# EAGLE schematic module (EAGLE 7.7.0)
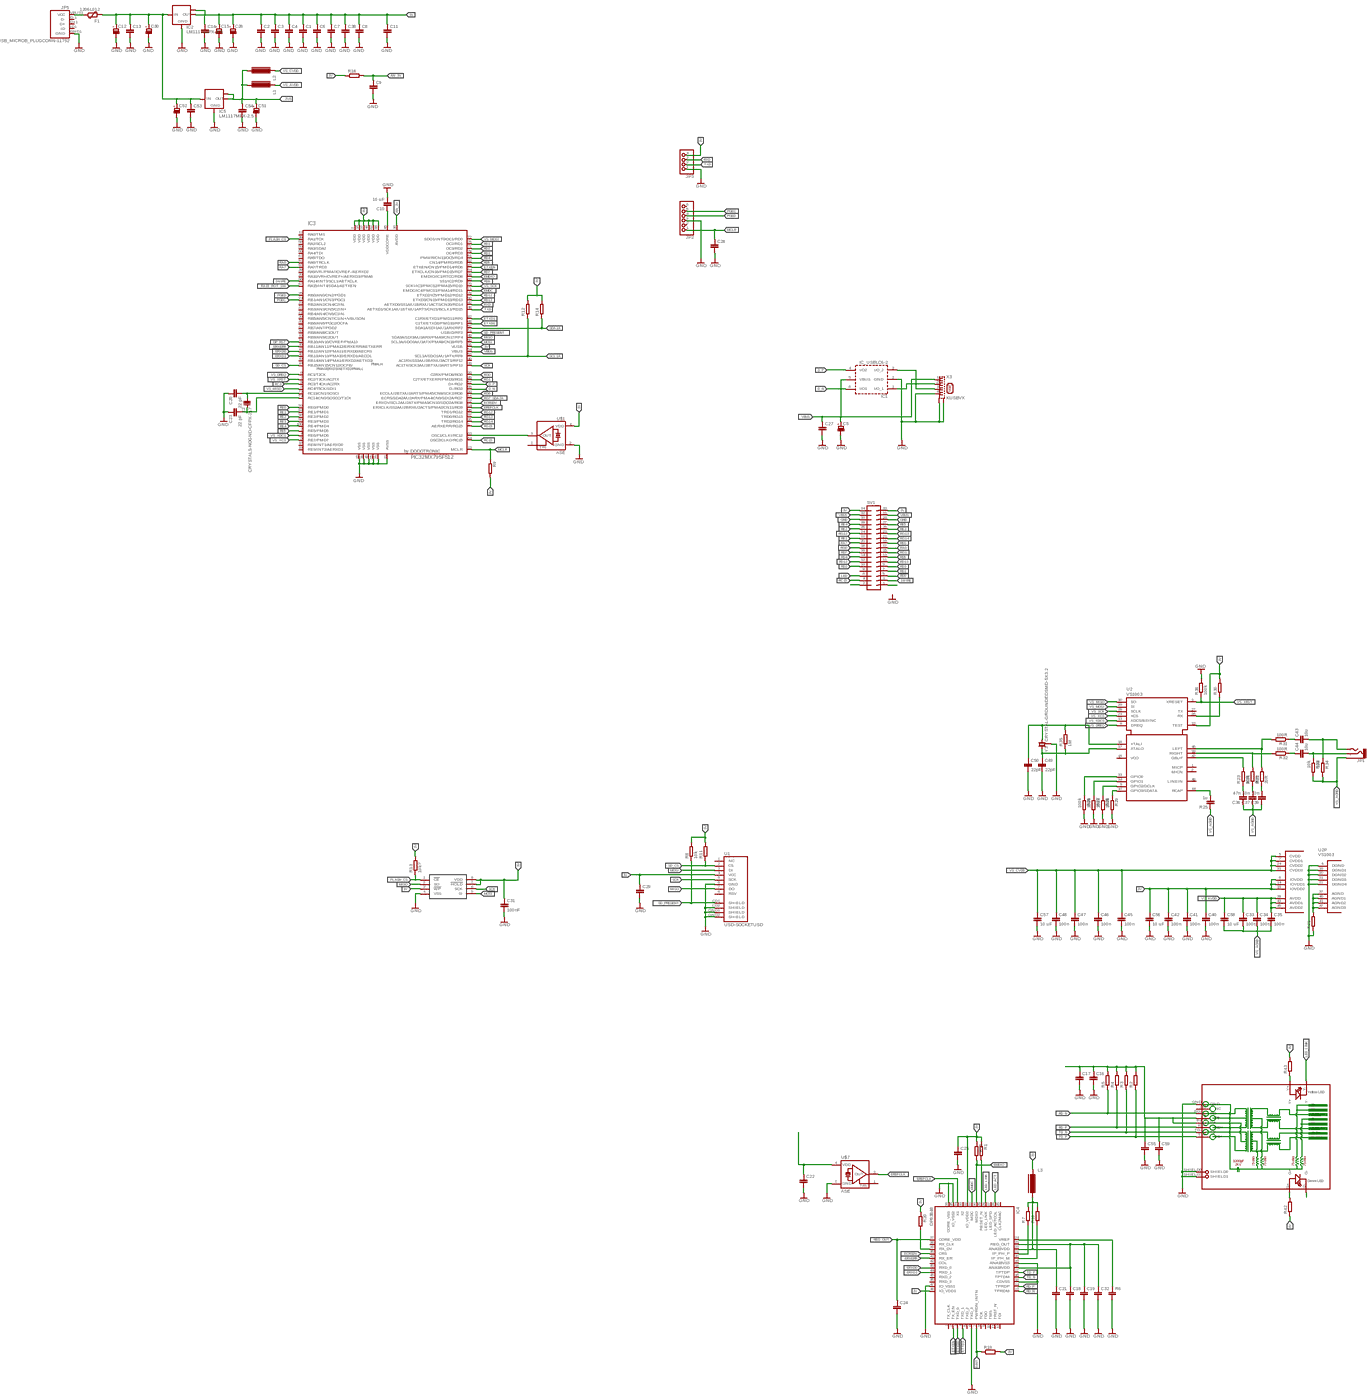
[diagram p0: schematic, sheet 1, overview]
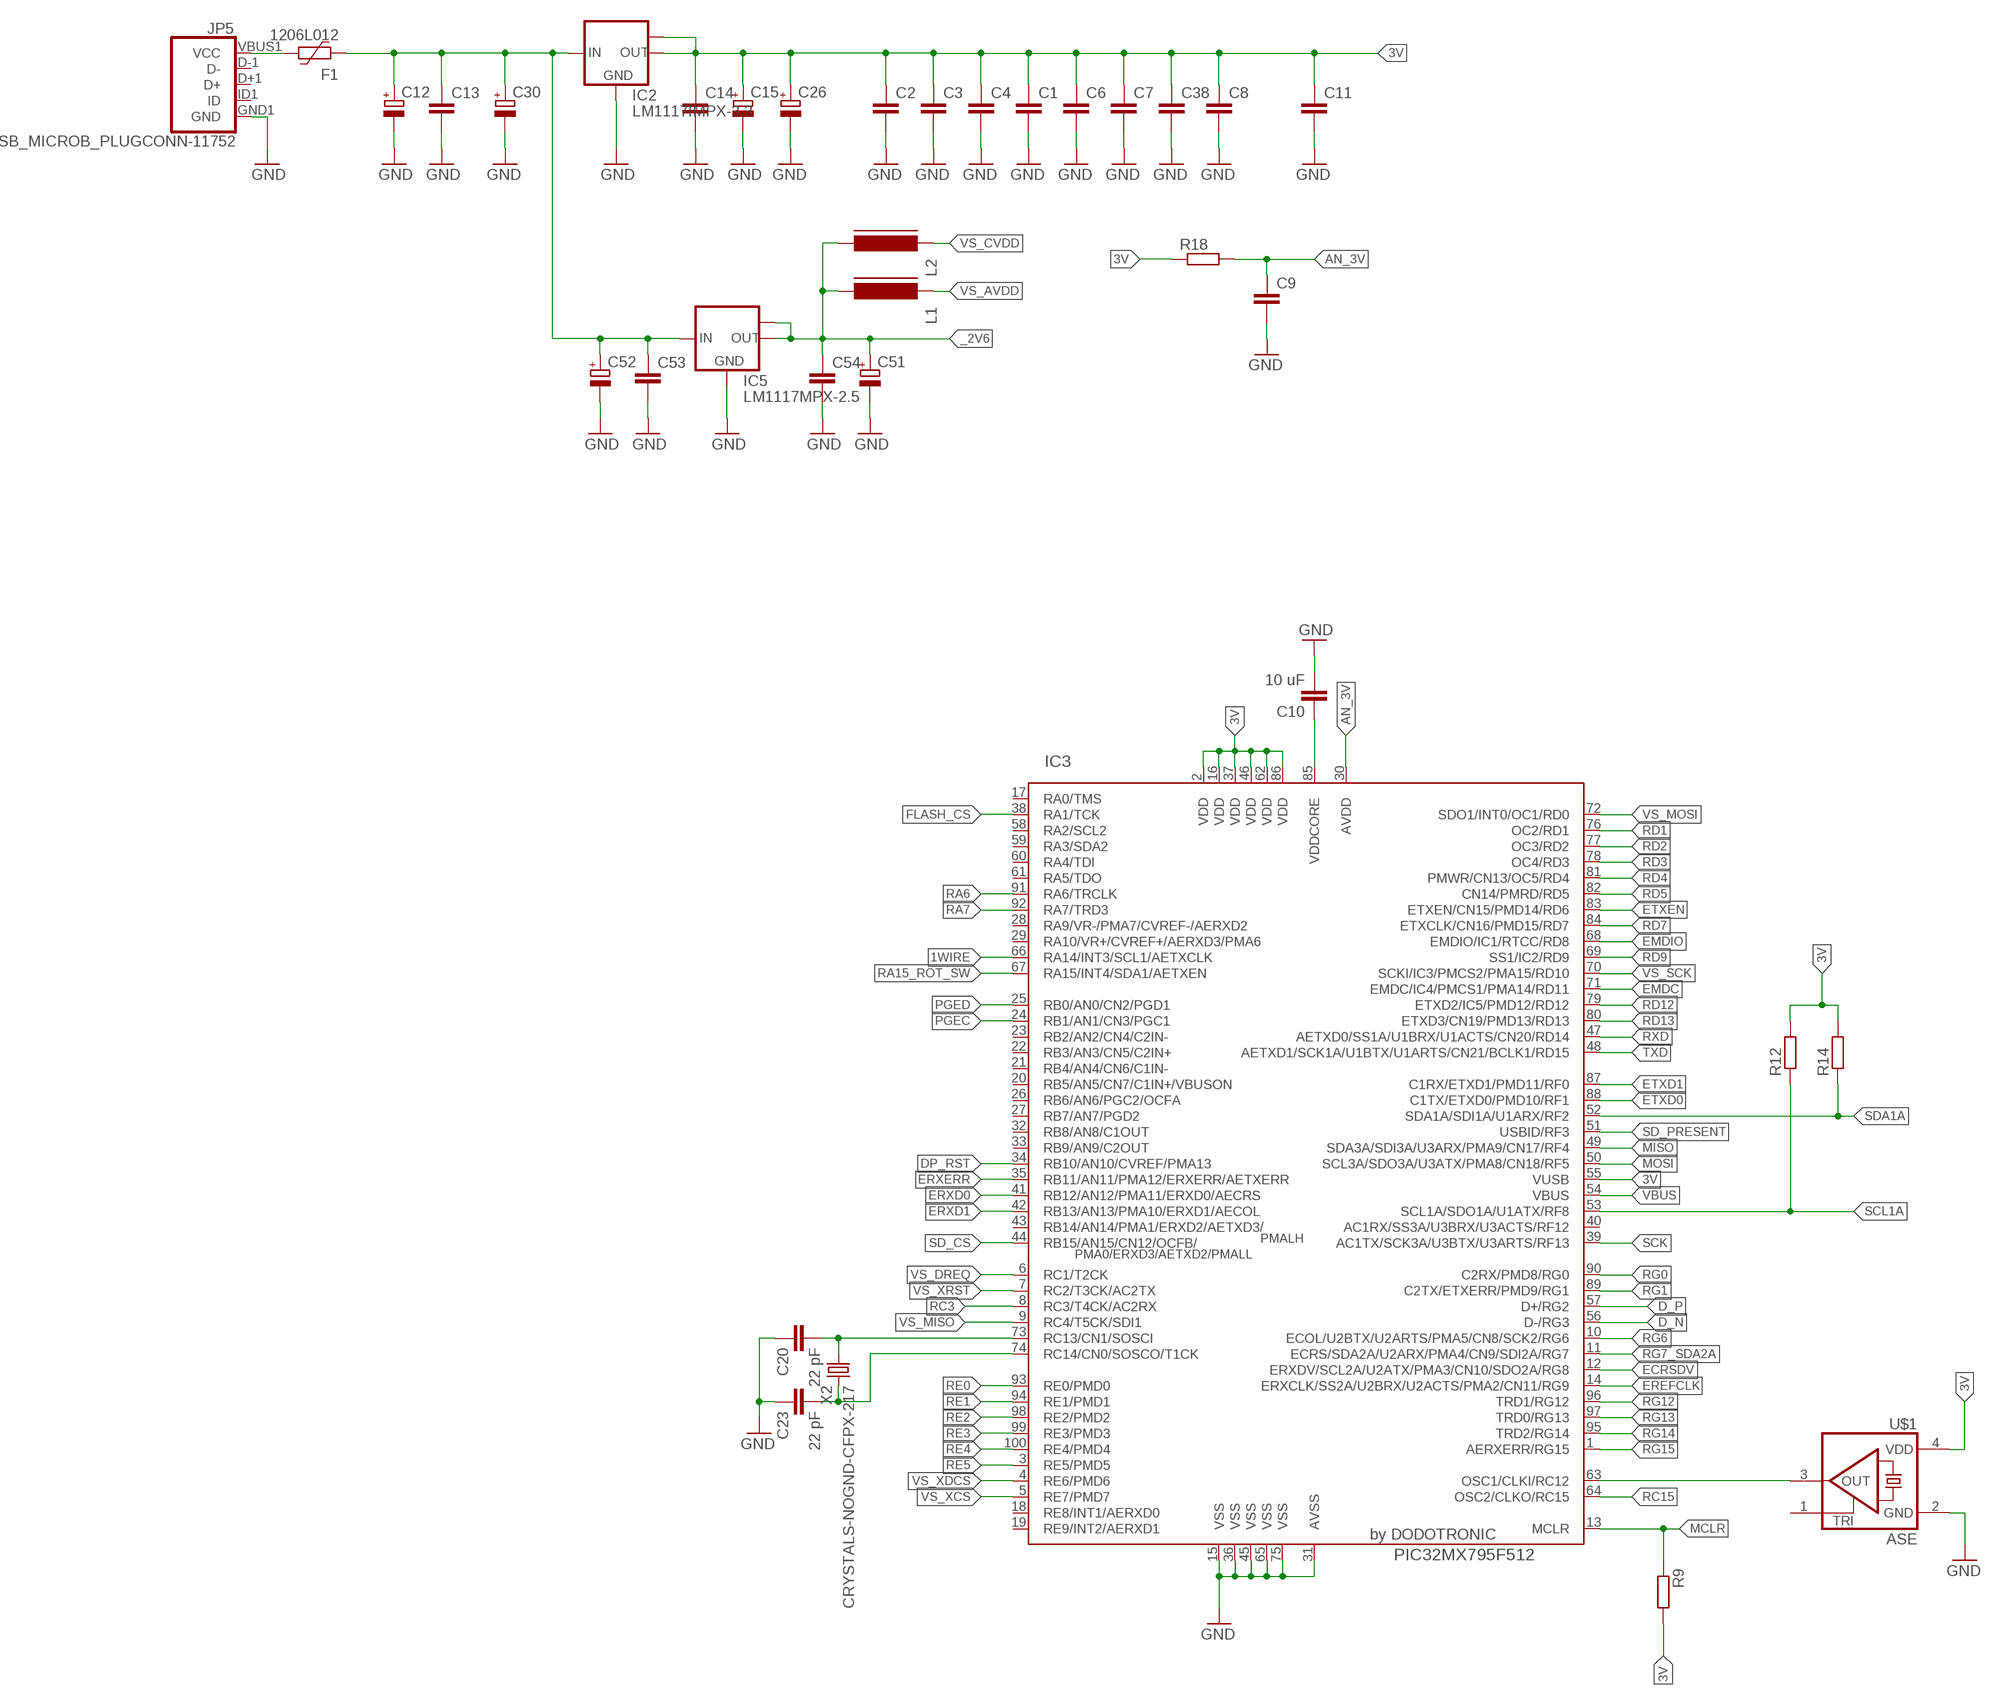
[diagram p1: schematic, sheet 1, part 1 of 4]
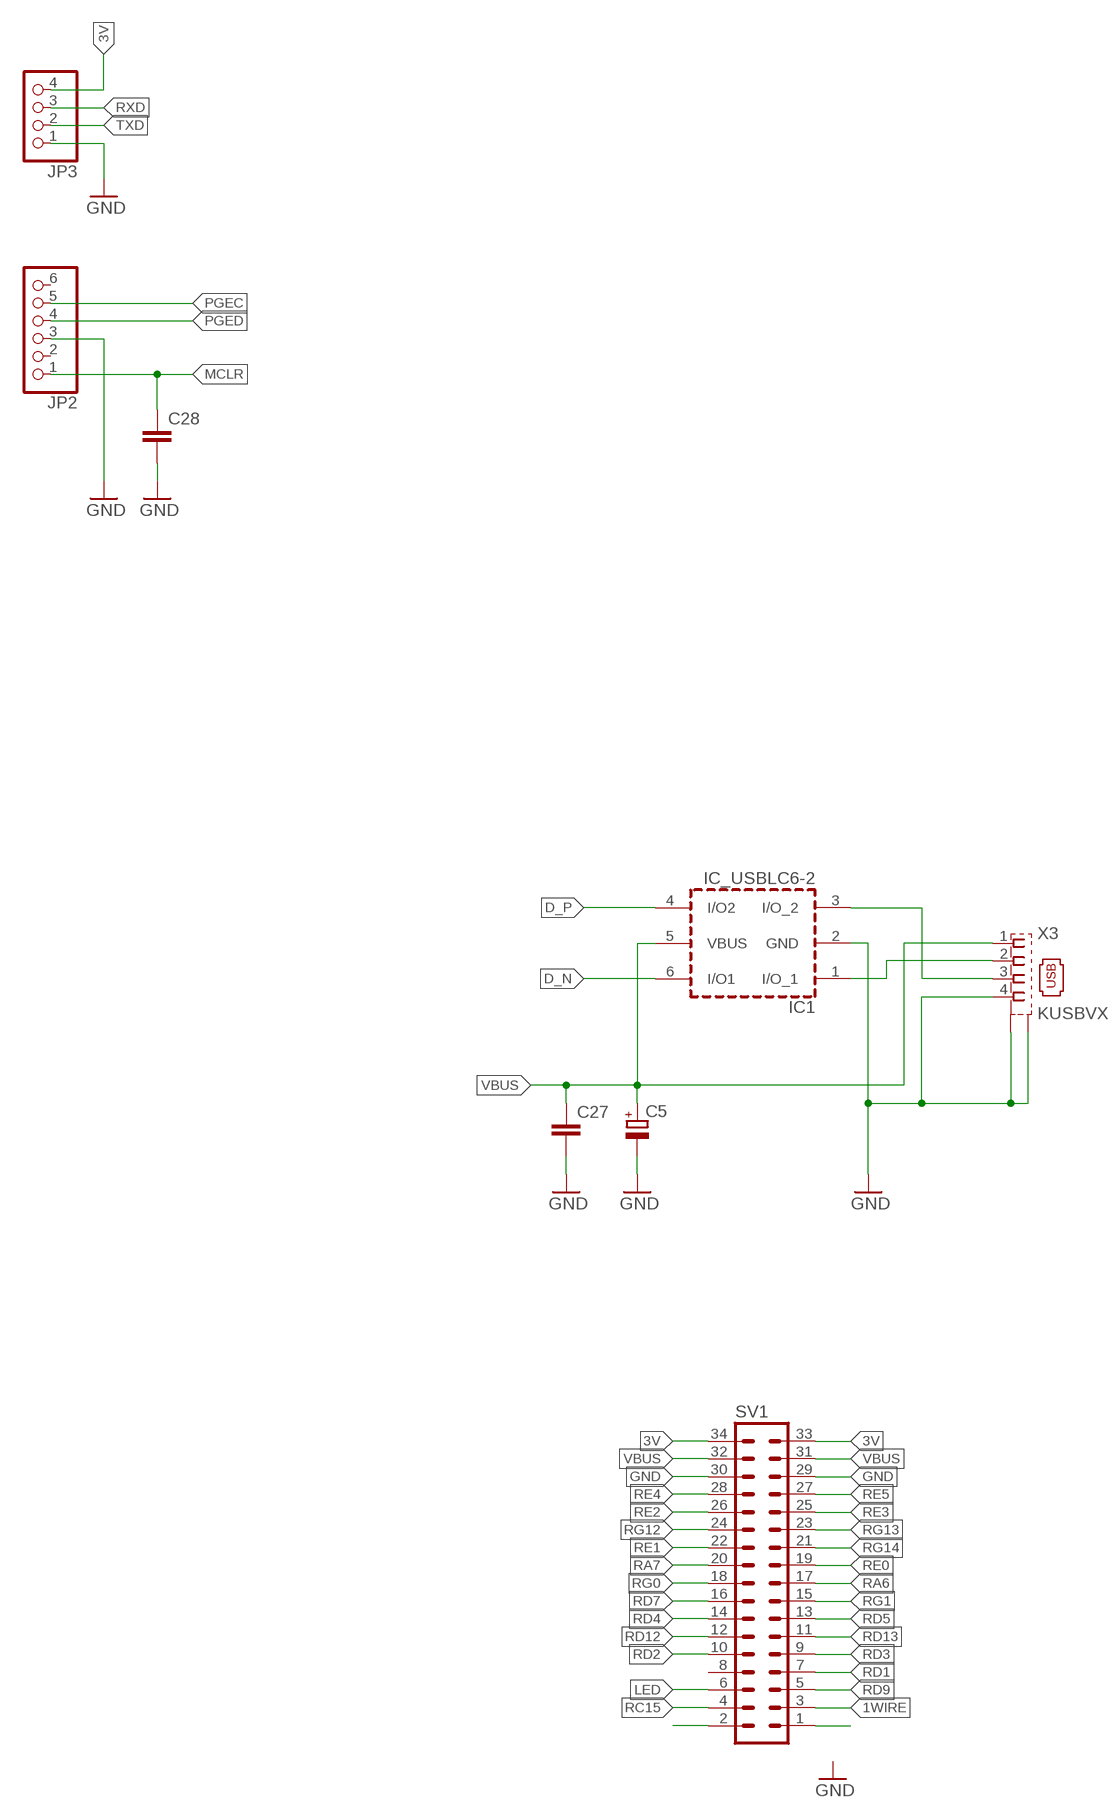
[diagram p2: schematic, sheet 1, part 2 of 4]
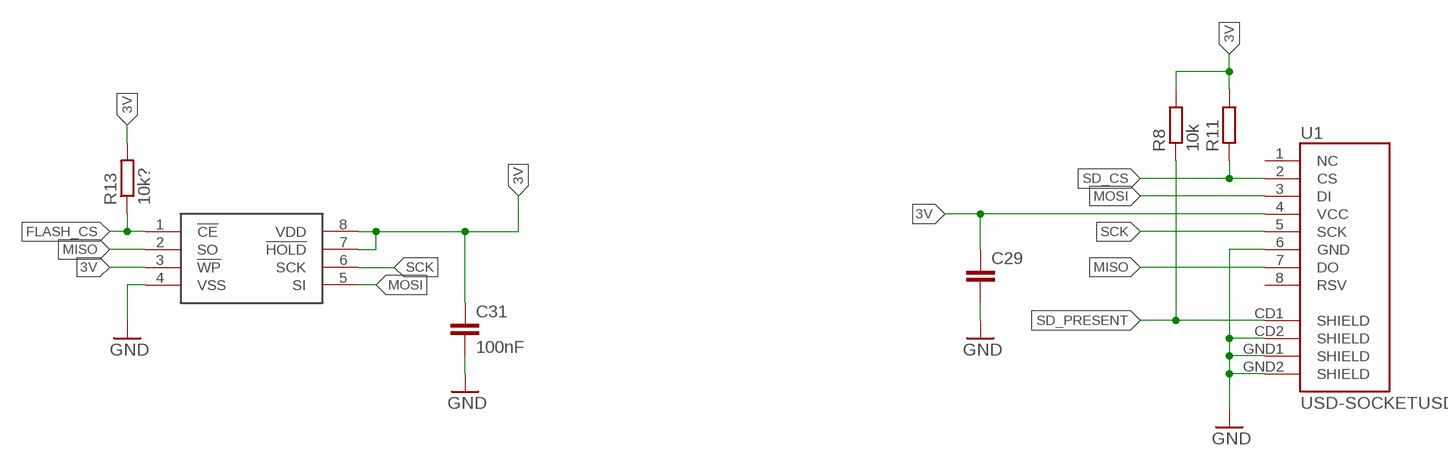
[diagram p3: schematic, sheet 1, part 3 of 4]
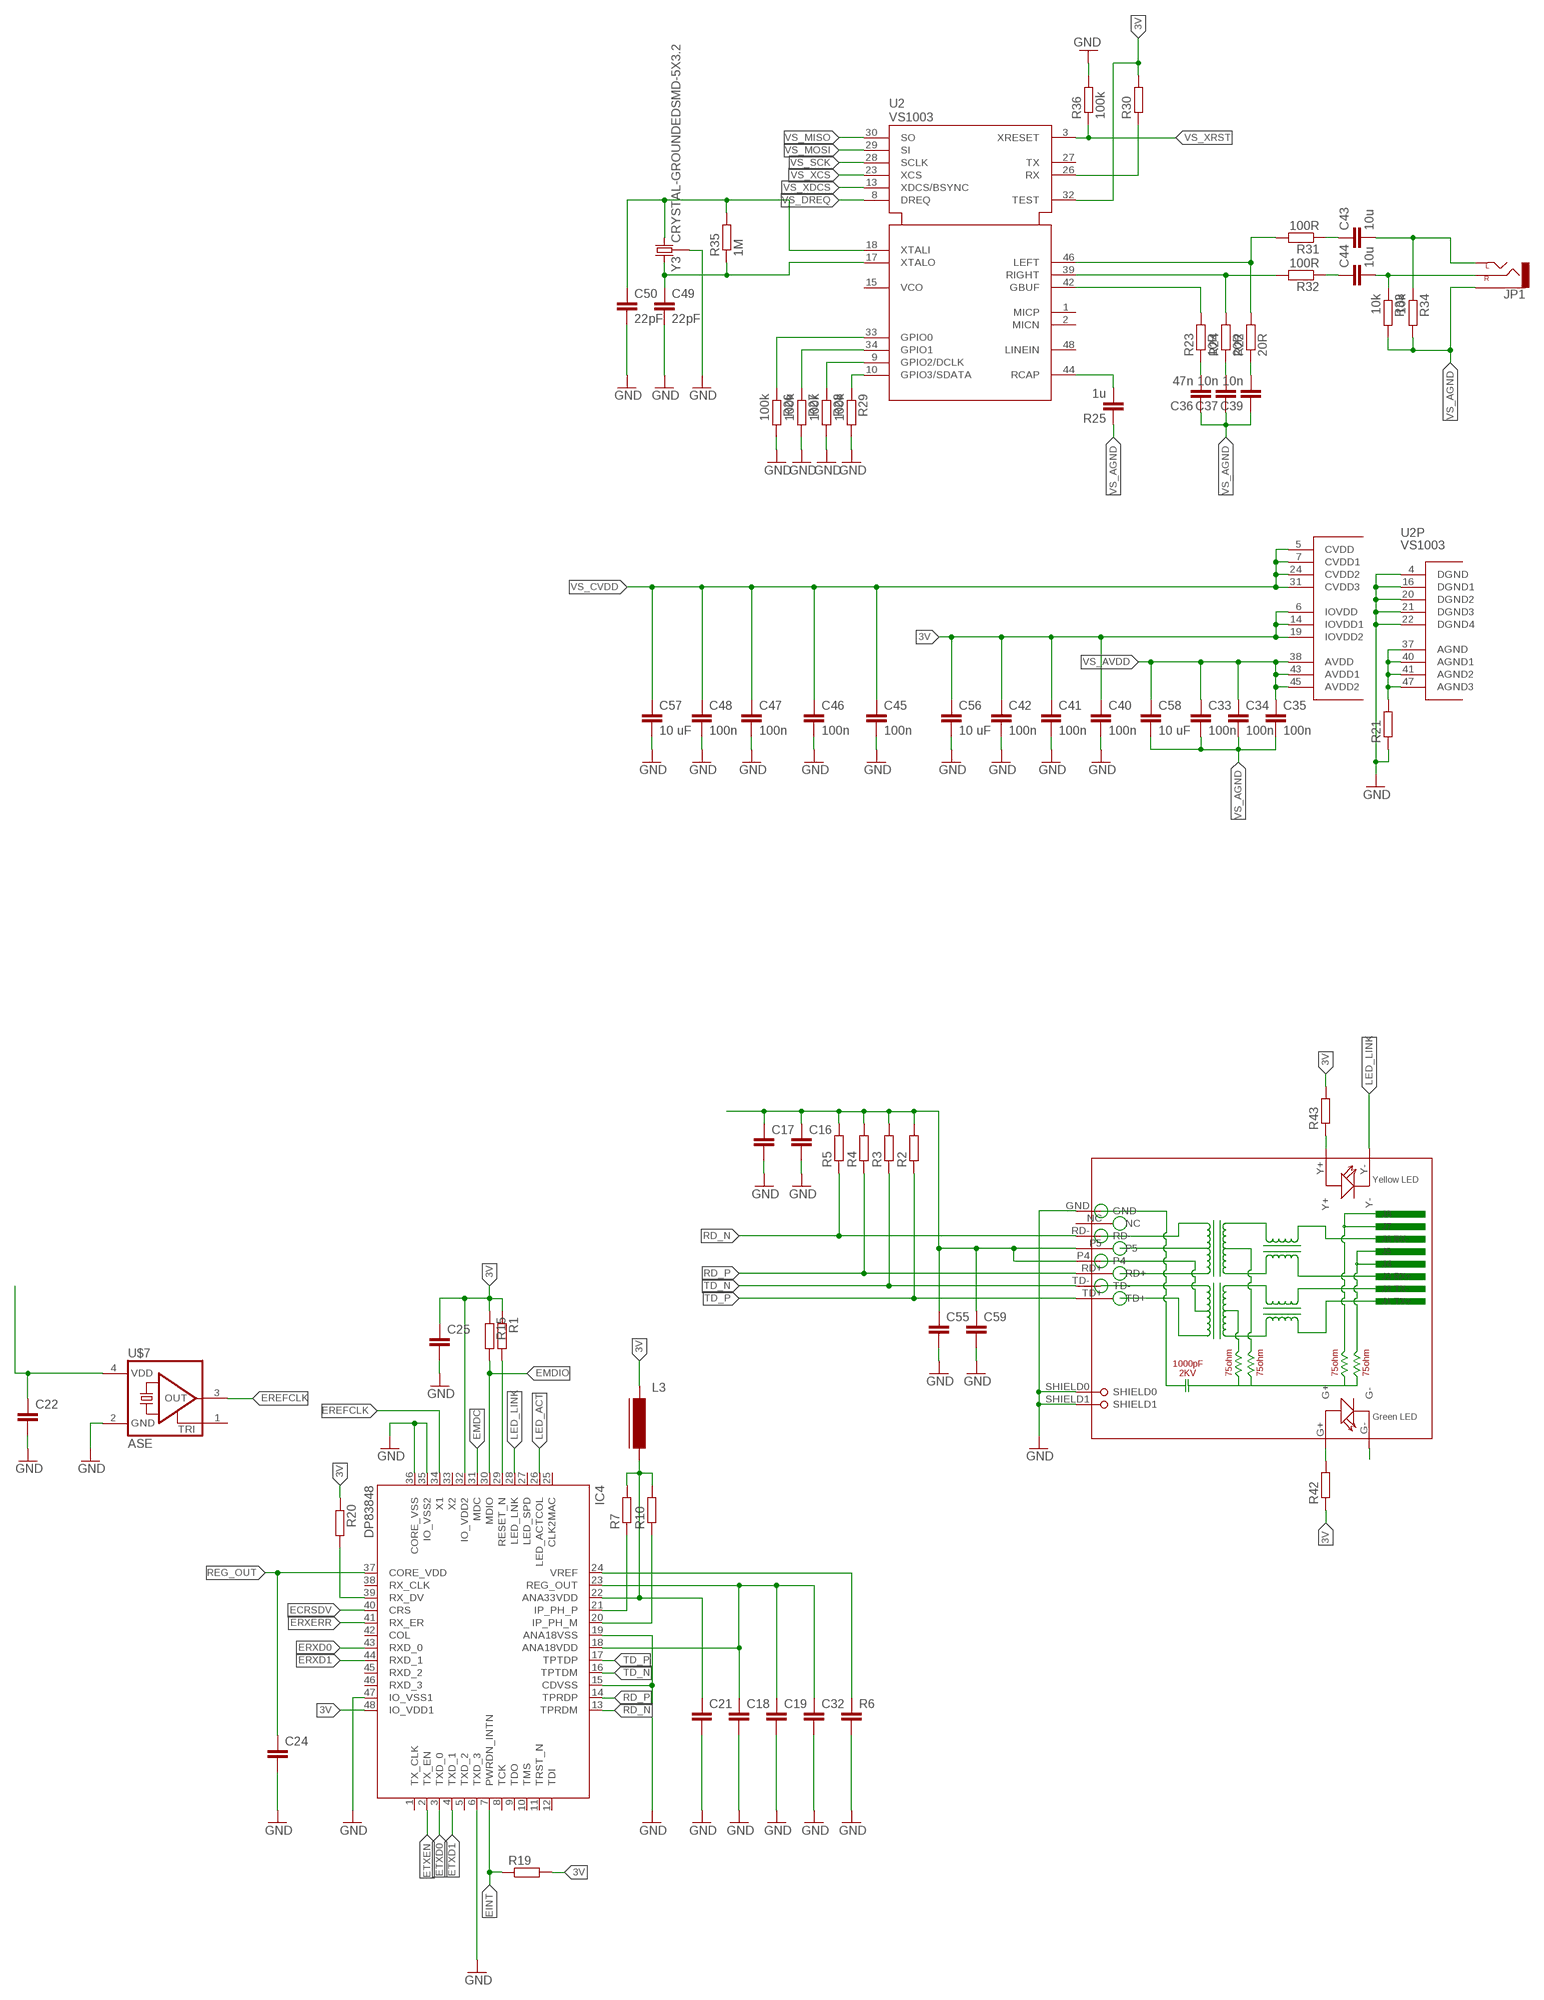
[diagram p4: schematic, sheet 1, part 4 of 4]

## Parts
C1  C-EUC0402  [C0402]
C2  C-EUC0402  [C0402]
C3  C-EUC0402  [C0402]
C4  C-EUC0402  [C0402]
C5  CPOL-EUSMCA  [SMC_A]
C6  C-EUC0402  [C0402]
C7  C-EUC0402  [C0402]
C8  C-EUC0402  [C0402]
C9  C-EUC0402  [C0402]
C10  10 uF  C-EUC0603  [C0603]
C11  C-EUC0402  [C0402]
C12  CPOL-EUSMCB  [SMC_B]
C13  C-EUC0603  [C0603]
C14  C-EUC0603  [C0603]
C15  CPOL-EUSMCB  [SMC_B]
C16  C-EUC0603  [C0603]
C17  C-EUC0603  [C0603]
C18  C-EUC0402  [C0402]
C19  C-EUC0402  [C0402]
C20  22 pF  C-EUC0603  [C0603]
C21  C-EUC0402  [C0402]
C22  C-EUC0402  [C0402]
C23  22 pF  C-EUC0603  [C0603]
C24  C-EUC0603  [C0603]
C25  C-EUC0603  [C0603]
C26  CPOL-EUSMCA  [SMC_A]
C27  C-EUC0603  [C0603]
C28  C-EUC0603  [C0603]
C29  C-EUC0603  [C0603]
C30  CPOL-EUSMCA  [SMC_A]
C31  100nF  C-EUC0603  [C0603]
C32  C-EUC0603  [C0603]
C33  100n  C-EUC0603  [C0603]
C34  100n  C-EUC0603  [C0603]
C35  100n  C-EUC0603  [C0603]
C36  47n  C-EUC0603  [C0603]
C37  10n  C-EUC0603  [C0603]
C38  C-EUC0402  [C0402]
C39  10n  C-EUC0603  [C0603]
C40  100n  C-EUC0402  [C0402]
C41  100n  C-EUC0402  [C0402]
C42  100n  C-EUC0402  [C0402]
C43  10u  C-EUC0603  [C0603]
C44  10u  C-EUC0603  [C0603]
C45  100n  C-EUC0402  [C0402]
C46  100n  C-EUC0603  [C0603]
C47  100n  C-EUC0603  [C0603]
C48  100n  C-EUC0603  [C0603]
C49  22pF  C-EUC0603  [C0603]
C50  22pF  C-EUC0603  [C0603]
C51  CPOL-EUSMCB  [SMC_B]
C52  CPOL-EUSMCB  [SMC_B]
C53  C-EUC1206  [C1206]
C54  C-EUC1206  [C1206]
C55  C-EUC0603  [C0603]
C56  10 uF  C-EUC0603  [C0603]
C57  10 uF  C-EUC0603  [C0603]
C58  10 uF  C-EUC0603  [C0603]
C59  C-EUC0603  [C0603]
F1  1206L012  [1206L]
IC1  IC_USBLC6-2  [SOT-23-6L]
IC2  LM1117IMPX-3.3  [SOT223]
IC3  PIC32MX795F512  [TQFP100_12X12]
IC4  DP83848  [LQFP48]
IC5  LM1117MPX-2.5  [SOT223]
JP1  AUDIO-JACKAUDIO_JACK2  [AUDIO-JACK2]
JP2  PINHD-1X6  [1X06]
JP3  PINHD-1X4  [1X04]
JP5  USB_MICROB_PLUGCONN-11752  [USB-B-MICRO-SMD_V03]
L1  FERRITE-0805  [FB805]
L2  FERRITE-0805  [FB805]
L3  FERRITE-0805  [FB805]
R1  R-EU_R0402  [R0402]
R2  R-EU_R0603  [R0603]
R3  R-EU_R0603  [R0603]
R4  R-EU_R0603  [R0603]
R5  R-EU_R0603  [R0603]
R6  C-EUC0603  [C0603]
R7  R-EU_R0402  [R0402]
R8  10k  R-EU_R0603  [R0603]
R9  R-EU_R0603  [R0603]
R10  R-EU_R0402  [R0402]
R11  R-EU_R0603  [R0603]
R12  R-EU_R0603  [R0603]
R13  10k?  R-EU_R0603  [R0603]
R14  R-EU_R0402  [R0402]
R15  R-EU_R0603  [R0603]
R18  R-EU_R0805  [R0805]
R19  R-EU_R0402  [R0402]
R20  R-EU_R0603  [R0603]
R21  R-EU_R0603  [R0603]
R22  20R  R-EU_R0603  [R0603]
R23  10R  R-EU_R0603  [R0603]
R24  20R  R-EU_R0603  [R0603]
R25  1u  C-EUC0603  [C0603]
R26  100k  R-EU_R0402  [R0402]
R27  100k  R-EU_R0402  [R0402]
R28  100k  R-EU_R0402  [R0402]
R29  100k  R-EU_R0402  [R0402]
R30  R-EU_0204/7  [0204/7]
R31  100R  R-EU_R0603  [R0603]
R32  100R  R-EU_R0603  [R0603]
R33  10k  R-EU_R0603  [R0603]
R34  10k  R-EU_R0603  [R0603]
R35  1M  R-EU_R0603  [R0603]
R36  100k  R-EU_R0603  [R0603]
R42  R-EU_R0603  [R0603]
R43  R-EU_R0603  [R0603]
RJ1  HR911105A  [HR911105A]
SV1  ML34L  [ML34L]
U1  USD-SOCKETUSD  [USD-SOCKET-PP]
U2  VS1003  [LQFP48]
U$1  ASE  [ASE]
U$2  SST25VF016BSO8M  [SO-08M]
U$7  ASE  [ASE]
X2  CRYSTALS-NOGND-CFPX-217  [3.2X1.5-2-PAD]
X3  KUSBVX  [KUSBVX]
Y3  CRYSTAL-GROUNDEDSMD-5X3.2  [CRYSTAL-SMD-5X3.2-4PAD]

## Nets
1WIRE: IC3.66(RA14/INT3/SCL1/AETXCLK) SV1.3
3V: C1.1 C2.1 C3.1 C4.1 C6.1 C7.1 C8.1 C11.1 C14.1 C15.+ C22.1 C25.1 C26.+ C29.1 C31.1 C38.1 C40.1 C41.1 C42.1 C56.1 IC2.2(OUT) IC2.TAB(OUT1) IC3.2(VDD) IC3.16(VDD) IC3.37(VDD) IC3.46(VDD) IC3.55(VUSB) IC3.62(VDD) IC3.86(VDD) IC4.32(IO_VDD2) IC4.48(IO_VDD1) JP3.4 L3.1 R1.1 R8.2 R9.2 R11.2 R12.2 R13.2 R14.2 R15.1 R18.1 R19.2 R20.1 R30.2 R42.1 R43.2 SV1.33 SV1.34 U1.4(VCC) U2.6(IOVDD) U2.14(IOVDD1) U2.19(IOVDD2) U2.32(TEST) U$1.4(VDD) U$2.3(!WP) U$2.7(!HOLD) U$2.8(VDD) U$7.4(VDD)
_2V6: C51.+ C54.1 IC5.2(OUT) IC5.TAB(OUT1) L1.2 L2.2
A3V: C16.1 C17.1 C21.1 C55.1 C59.1 IC4.22(ANA33VDD) L3.2 R2.2 R3.2 R4.2 R5.2 R7.2 R10.2 RJ1.P4 RJ1.P5
AN_3V: C9.1 IC3.30(AVDD) R18.2
D2_N: IC1.1(I/O_1) X3.2
D2_P: IC1.3(I/O_2) X3.3
D_N: IC1.6(I/O1) IC3.56(D-/RG3)
D_P: IC1.4(I/O2) IC3.57(D+/RG2)
DP_RST: IC3.34(RB10/AN10/CVREF/PMA13) IC4.29(RESET_N) R1.2
ECRSDV: IC3.12(ERXDV/SCL2A/U2ATX/PMA3/CN10/SDO2A/RG8) IC4.40(CRS)
EINT: IC4.7(PWRDN_INTN) R19.1
EMDC: IC3.71(EMDC/IC4/PMCS1/PMA14/RD11) IC4.31(MDC)
EMDIO: IC3.68(EMDIO/IC1/RTCC/RD8) IC4.30(MDIO) R15.2
EREFCLK: IC3.14(ERXCLK/SS2A/U2BRX/U2ACTS/PMA2/CN11/RG9) IC4.34(X1) U$7.3(OUT)
ERXD0: IC3.41(RB12/AN12/PMA11/ERXD0/AECRS) IC4.43(RXD_0)
ERXD1: IC3.42(RB13/AN13/PMA10/ERXD1/AECOL) IC4.44(RXD_1)
ERXERR: IC3.35(RB11/AN11/PMA12/ERXERR/AETXERR) IC4.41(RX_ER)
ETXD0: IC3.88(C1TX/ETXD0/PMD10/RF1) IC4.3(TXD_0)
ETXD1: IC3.87(C1RX/ETXD1/PMD11/RF0) IC4.4(TXD_1)
ETXEN: IC3.83(ETXEN/CN15/PMD14/RD6) IC4.2(TX_EN)
FLASH_CS: IC3.38(RA1/TCK) R13.1 U$2.1(!CE)
GND: C1.2 C2.2 C3.2 C4.2 C5.- C6.2 C7.2 C8.2 C9.2 C10.2 C11.2 C12.- C13.2 C14.2 C15.- C16.2 C17.2 C18.2 C19.2 C20.1 C21.2 C22.2 C23.1 C24.2 C25.2 C26.- C27.2 C28.2 C29.2 C30.- C31.2 C32.2 C38.2 C40.2 C41.2 C42.2 C45.2 C46.2 C47.2 C48.2 C49.2 C50.2 C51.- C52.- C53.2 C54.2 C55.2 C56.2 C57.2 C59.2 IC1.2(GND) IC2.1(GND) IC3.15(VSS) IC3.31(AVSS) IC3.36(VSS) IC3.45(VSS) IC3.65(VSS) IC3.75(VSS) IC4.6(TXD_3) IC4.15(CDVSS) IC4.19(ANA18VSS) IC4.35(IO_VSS2) IC4.36(CORE_VSS) IC4.47(IO_VSS1) IC5.1(GND) JP2.3 JP3.1 JP5.GND1(GND) R6.2 R21.1 R26.2 R27.2 R28.2 R29.2 R36.2 RJ1.GND RJ1.SHIELD0 RJ1.SHIELD1 SV1.29 SV1.30 U1.6(GND) U1.CD2(SHIELD) U1.GND1(SHIELD) U1.GND2(SHIELD) U2.4(DGND) U2.16(DGND1) U2.20(DGND2) U2.21(DGND3) U2.22(DGND4) U$1.2(GND) U$2.4(VSS) U$7.2(GND) X3.4 X3.M1(S1) X3.M2(S2) Y3.2 Y3.4
LED: SV1.6
LED_ACT: IC4.26(LED_ACTCOL) RJ1.G-
LED_LINK: IC4.28(LED_LNK) RJ1.Y-
MCLR: C28.1 IC3.13(MCLR) JP2.1 R9.1
MISO: IC3.49(SDA3A/SDI3A/U3ARX/PMA9/CN17/RF4) U1.7(DO) U$2.2(SO)
MOSI: IC3.50(SCL3A/SDO3A/U3ATX/PMA8/CN18/RF5) U1.3(DI) U$2.5(SI)
N$1: IC4.21(IP_PH_P) R7.1
N$3: IC4.24(VREF) R6.1
N$6: IC4.20(IP_PH_M) R10.1
N$10: C10.1 IC3.85(VDDCORE)
N$12: R42.2 RJ1.G+
N$17: F1.1 JP5.VBUS1(VCC)
N$18: C36.2 R23.1
N$19: R43.1 RJ1.Y+
PGEC: IC3.24(RB1/AN1/CN3/PGC1) JP2.5
PGED: IC3.25(RB0/AN0/CN2/PGD1) JP2.4
PH0: IC3.63(OSC1/CLKI/RC12) U$1.3(OUT)
RA6: IC3.91(RA6/TRCLK) SV1.17
RA7: IC3.92(RA7/TRD3) SV1.20
RA15_ROT_SW: IC3.67(RA15/INT4/SDA1/AETXEN)
RC3: IC3.8(RC3/T4CK/AC2RX)
RC15: IC3.64(OSC2/CLKO/RC15) SV1.4
RD1: IC3.76(OC2/RD1) SV1.7
RD2: IC3.77(OC3/RD2) SV1.10
RD3: IC3.78(OC4/RD3) SV1.9
RD4: IC3.81(PMWR/CN13/OC5/RD4) SV1.14
RD5: IC3.82(CN14/PMRD/RD5) SV1.13
RD7: IC3.84(ETXCLK/CN16/PMD15/RD7) SV1.16
RD9: IC3.69(SS1/IC2/RD9) SV1.5
RD12: IC3.79(ETXD2/IC5/PMD12/RD12) SV1.12
RD13: IC3.80(ETXD3/CN19/PMD13/RD13) SV1.11
RD_N: IC4.13(TPRDM) R5.1 RJ1.RD-
RD_P: IC4.14(TPRDP) R4.1 RJ1.RD+
RE0: IC3.93(RE0/PMD0) SV1.19
RE1: IC3.94(RE1/PMD1) SV1.22
RE2: IC3.98(RE2/PMD2) SV1.26
RE3: IC3.99(RE3/PMD3) SV1.25
RE4: IC3.100(RE4/PMD4) SV1.28
RE5: IC3.3(RE5/PMD5) SV1.27
REG_OUT: C18.1 C19.1 C24.1 C32.1 IC4.18(ANA18VDD) IC4.23(REG_OUT) IC4.37(CORE_VDD)
RG0: IC3.90(C2RX/PMD8/RG0) SV1.18
RG1: IC3.89(C2TX/ETXERR/PMD9/RG1) SV1.15
RG6: IC3.10(ECOL/U2BTX/U2ARTS/PMA5/CN8/SCK2/RG6)
RG7_SDA2A: IC3.11(ECRS/SDA2A/U2ARX/PMA4/CN9/SDI2A/RG7)
RG12: IC3.96(TRD1/RG12) SV1.24
RG13: IC3.97(TRD0/RG13) SV1.23
RG14: IC3.95(TRD2/RG14) SV1.21
RG15: IC3.1(AERXERR/RG15)
RX_DV: IC4.39(RX_DV) R20.2
RXD: IC3.47(AETXD0/SS1A/U1BRX/U1ACTS/CN20/RD14) JP3.3
SCK: IC3.39(AC1TX/SCK3A/U3BTX/U3ARTS/RF13) U1.5(SCK) U$2.6(SCK)
SCL1A: IC3.53(SCL1A/SDO1A/U1ATX/RF8) R12.1 SV1.1
SD_CS: IC3.44(RB15/AN15/CN12/OCFB/) R11.1 U1.2(CS)
SD_PRESENT: IC3.51(USBID/RF3) R8.1 U1.CD1(SHIELD)
SDA1A: IC3.52(SDA1A/SDI1A/U1ARX/RF2) R14.1 SV1.2
SOSCI: C20.2 IC3.73(RC13/CN1/SOSCI) X2.1
SOSCO: C23.2 IC3.74(RC14/CN0/SOSCO/T1CK) X2.2
TD_N: IC4.16(TPTDM) R3.1 RJ1.TD-
TD_P: IC4.17(TPTDP) R2.1 RJ1.TD+
TXD: IC3.48(AETXD1/SCK1A/U1BTX/U1ARTS/CN21/BCLK1/RD15) JP3.2
VBUS: C5.+ C12.+ C13.1 C27.1 C30.+ C52.+ C53.1 F1.2 IC1.5(VBUS) IC2.3(IN) IC3.54(VBUS) IC5.3(IN) SV1.31 SV1.32 X3.1
VS_AGND: C33.2 C34.2 C35.2 C36.1 C37.1 C39.1 C58.2 JP1.SLEEVE R21.2 R25.1 R33.2 R34.2 U2.37(AGND) U2.40(AGND1) U2.41(AGND2) U2.47(AGND3)
VS_AVDD: C33.1 C34.1 C35.1 C58.1 L1.1 U2.38(AVDD) U2.43(AVDD1) U2.45(AVDD2)
VS_CVDD: C45.1 C46.1 C47.1 C48.1 C57.1 L2.1 U2.5(CVDD) U2.7(CVDD1) U2.24(CVDD2) U2.31(CVDD3)
VS_DREQ: IC3.6(RC1/T2CK) U2.8(DREQ)
VS_MISO: IC3.9(RC4/T5CK/SDI1) U2.30(SO)
VS_MOSI: IC3.72(SDO1/INT0/OC1/RD0) U2.29(SI)
VS_N$9: C50.1 R35.2 U2.18(XTALI) Y3.1
VS_N$13: C49.1 R35.1 U2.17(XTALO) Y3.3
VS_N$14: R22.2 R31.2 U2.46(LEFT)
VS_N$15: R23.2 U2.42(GBUF)
VS_N$16: R24.2 R32.2 U2.39(RIGHT)
VS_N$17: R25.2 U2.44(RCAP)
VS_N$24: C37.2 R24.1
VS_N$25: C39.2 R22.1
VS_N$26: R29.1 U2.10(GPIO3/SDATA)
VS_N$27: R28.1 U2.9(GPIO2/DCLK)
VS_N$28: R27.1 U2.34(GPIO1)
VS_N$30: R26.1 U2.33(GPIO0)
VS_N$34: R30.1 U2.26(RX)
VS_N$35: C43.1 R31.1
VS_N$36: C44.1 R32.1
VS_N$37: C44.2 JP1.RING(RIGHT) R33.1
VS_N$38: C43.2 JP1.TIP(LEFT) R34.1
VS_SCK: IC3.70(SCKI/IC3/PMCS2/PMA15/RD10) U2.28(SCLK)
VS_XCS: IC3.5(RE7/PMD7) U2.23(XCS)
VS_XDCS: IC3.4(RE6/PMD6) U2.13(XDCS/BSYNC)
VS_XRST: IC3.7(RC2/T3CK/AC2TX) R36.1 U2.3(XRESET)
Unconnected: IC3.17(RA0/TMS) IC3.18(RE8/INT1/AERXD0) IC3.19(RE9/INT2/AERXD1) IC3.20(RB5/AN5/CN7/C1IN+/VBUSON) IC3.21(RB4/AN4/CN6/C1IN-) IC3.22(RB3/AN3/CN5/C2IN+) IC3.23(RB2/AN2/CN4/C2IN-) IC3.26(RB6/AN6/PGC2/OCFA) IC3.27(RB7/AN7/PGD2) IC3.28(RA9/VR-/PMA7/CVREF-/AERXD2) IC3.29(RA10/VR+/CVREF+/AERXD3/PMA6) IC3.32(RB8/AN8/C1OUT) IC3.33(RB9/AN9/C2OUT) IC3.40(AC1RX/SS3A/U3BRX/U3ACTS/RF12) IC3.43(RB14/AN14/PMA1/ERXD2/AETXD3/) IC3.58(RA2/SCL2) IC3.59(RA3/SDA2) IC3.60(RA4/TDI) IC3.61(RA5/TDO) IC4.1(TX_CLK) IC4.5(TXD_2) IC4.8(TCK) IC4.9(TDO) IC4.10(TMS) IC4.11(TRST_N) IC4.12(TDI) IC4.25(CLK2MAC) IC4.27(LED_SPD) IC4.33(X2) IC4.38(RX_CLK) IC4.42(COL) IC4.45(RXD_2) IC4.46(RXD_3) JP2.2 JP2.6 JP5.D+1(D+) JP5.D-1(D-) JP5.ID1(ID) RJ1.NC SV1.8 U1.1(NC) U1.8(RSV) U2.1(MICP) U2.2(MICN) U2.15(VCO) U2.27(TX) U2.48(LINEIN) U$1.1(TRI) U$7.1(TRI)

## Library data of the parts
C1-C4 C6-C11 C13 C14 C16-C25 C27-C29 C31-C50 C53-C59 R6 R25 = rcl:C-EU: CAPACITOR, European symbol
C5 C12 C15 C26 C30 C51 C52 = rcl:CPOL-EU: POLARIZED CAPACITOR, European symbol
F1 = polyfuse-smd_10:?: Polyfuse Resettable PTC Source: http://www.littelfuse.com/products/resettable-ptcs.aspx; MF: Littelfuse; MPN: 1206L012; OC_FARNELL: 1596988; OC_NEWARK: 05M2298
IC1 = dp_devices:IC_USBLC6-2
IC2 = lm1117:LM1117IMPX-*
IC3 = DodoMicroR3:PIC32MX795F512: USB, CAN and Ethernet 32-bit Flash Microcontroller
IC4 = national-semiconductor:DP83848: PHYTER® - Extended Temperature Single Port 10/100 Mb/s Ethernet Physical Layer Transceiver Auto generated by make-symbol-device-package-bsdl.ulp Rev. 34 Source: dp83848yb.bsdl http://www.national.com/ds/DP/DP83848VYB.pdf; MPN: DP83848VYB; OC_FARNELL: 1286817; OC_NEWARK: 11N4484
IC5 = lm1117:LM1117MPX-*
JP1 = SparkFun-Connectors:AUDIO-JACK: 3.5mm Audio Jack Simple 3.5mm common PCB mount audio jack. SKU: PRT-08032
JP2 = pinhead:PINHD-1X6: PIN HEADER
JP3 = pinhead:PINHD-1X4: PIN HEADER
JP5 = SparkFun-Connectors:USB_MICROB_PLUG: USB Micro-B connectors Some male, some female. Watch your step!; PROD_ID: CONN-11752
L1-L3 = dp_devices:FERRITE: Ferrite bead in various packages
R1-R5 R7-R15 R18-R24 R26-R36 R42 R43 = rcl:R-EU_: RESISTOR, European symbol
RJ1 = hanrun:HR911105A
SV1 = con-harting-ml:ML34: HARTING; OC_FARNELL: unknown; OC_NEWARK: unknown
U1 = SparkFun-Connectors:USD-SOCKET: microSD Socket Push-push type uSD socket. Schematic element and footprint production proven. Spark Fun Electronics SKU : PRT-00127. tDoc lines correctly indicate media card edge positions when inserting (unlocked, locked, depressed).
U2 = vlsi-web:VS1003: MP3 / WMA / MIDI Audio Codec Circuit
U$1 U$7 = crystal:ASE: 3.3Vdc CMOS SMD CRYSTAL CLOCK OSCILLATOR SOurce: www.abracon.com; OC_FARNELL: unknown; OC_NEWARK: unknown
U$2 = mw:SST25VF016B
X2 = IQD-Frequency-Products:CRYSTALS-NOGND: CRYSTALS CAN NOT GROUNDED
X3 = con-kycon:KUSBVX: Vertical,Top Entry Universal Serial Bus Connector KUSBVX Series Source: KYCON Sibalco USB vertical socket KUSBV.pdf
Y3 = SparkFun-Clocks:CRYSTAL-GROUNDED: Crystals w/ Ground Pin (Generic) These are passive quartz crystals, which can be used as a clock source for a microcontroller. Crystal's are usually two-terminal devices. A third terminal may be optionally connected to ground, as recommended by the manufaturer.